# Altium schematic sheet LTEModule.SchDoc
size A4; SheetNumber: 11; SheetTotal: 22
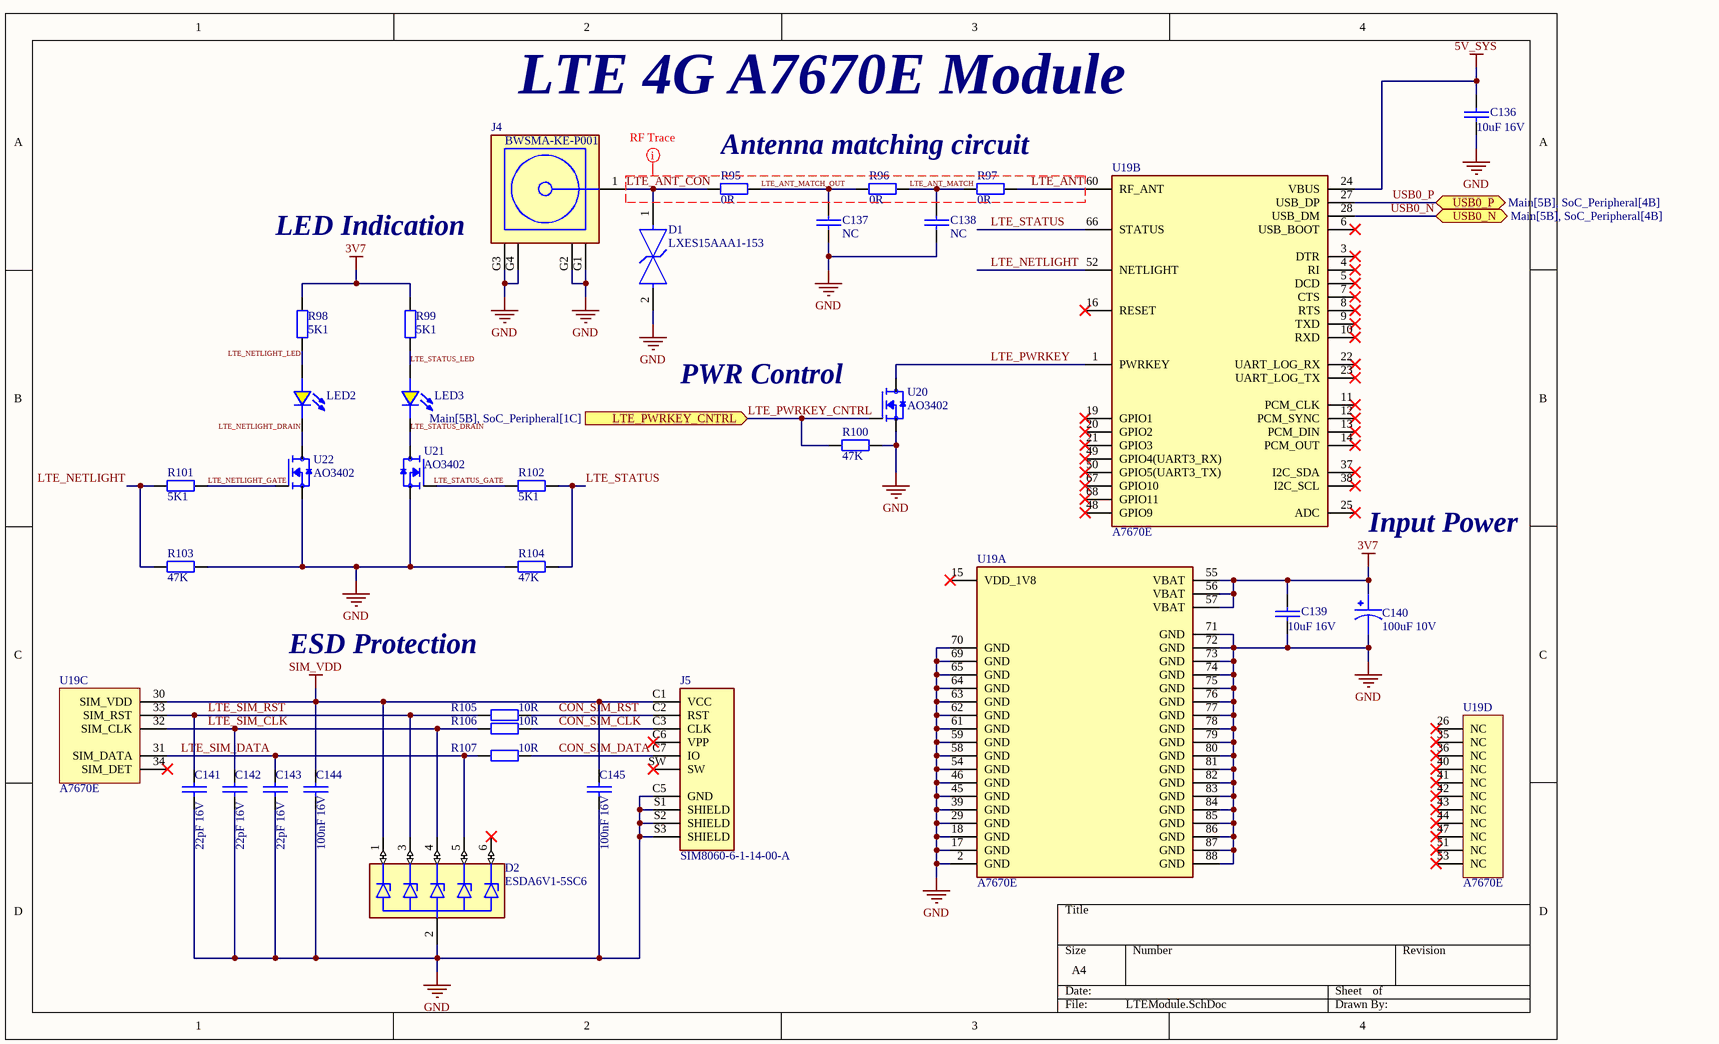
[diagram p0: LTEModule.SchDoc]

## Parts
C136  10uF 16V  [C_0603]
C137  NC  [C_0402]
C138  NC  [C_0402]
C139  10uF 16V  [C_0603]
C140  100uF 10V  [C_CASE-B]
C141  22pF 16V  [C_0402]
C142  22pF 16V  [C_0402]
C143  22pF 16V  [C_0402]
C144  100nF 16V  [C_0402]
C145  100nF 16V  [C_0402]
D1  LXES15AAA1-153  [FP-LXES15-MFG]
D2  ESDA6V1-5SC6  [SOT-23-6]
J4  BWSMA-KE-P001  [BATWIRELESS_BWSMA-KE-P001]
J5  SIM8060-6-1-14-00-A  [SIM8060-6-1-14-00-A]
LED2  LED_0603_YELLOW  [LED_0603]  (value not drawn)
LED3  LED_0603_YELLOW  [LED_0603]  (value not drawn)
R95  0R  [R_0402]
R96  0R  [R_0402]
R97  0R  [R_0402]
R98  5K1  [R_0603]
R99  5K1  [R_0603]
R100  47K  [R_0603]
R101  5K1  [R_0603]
R102  5K1  [R_0603]
R103  47K  [R_0603]
R104  47K  [R_0603]
R105  10R  [R_0402]
R106  10R  [R_0402]
R107  10R  [R_0402]
U19  A7670E  [A7670]  (parts A,B,C,D of 4)
U20  AO3402  [SOT-23-3]
U21  AO3402  [SOT-23-3]
U22  AO3402  [SOT-23-3]

## Ports
LTE_PWRKEY_CNTRL (in, see Main[5B], SoC_Peripheral[1C]), USB0_N (bidir, see Main[5B], SoC_Peripheral[4B]), USB0_P (bidir, see Main[5B], SoC_Peripheral[4B])

## Nets
3V7: C139.1 C140.1 R98.1 R99.1 U19.55(VBAT) U19.56(VBAT) U19.57(VBAT)
5V_SYS: C136.1 U19.24(VBUS)
GND: C136.2 C137.2 C138.2 C139.2 C140.2 C141.2 C142.2 C143.2 C144.2 C145.2 D1.2 D2.2(GND) J4.G1(GND) J4.G2(GND) J4.G3(GND) J4.G4(GND) J5.C5(GND) J5.S1(SHIELD) J5.S2(SHIELD) J5.S3(SHIELD) R100.2 R103.2 R104.1 U19.2(GND) U19.17(GND) U19.18(GND) U19.29(GND) U19.39(GND) U19.45(GND) U19.46(GND) U19.54(GND) U19.58(GND) U19.59(GND) U19.61(GND) U19.62(GND) U19.63(GND) U19.64(GND) U19.65(GND) U19.69(GND) U19.70(GND) U19.71(GND) U19.72(GND) U19.73(GND) U19.74(GND) U19.75(GND) U19.76(GND) U19.77(GND) U19.78(GND) U19.79(GND) U19.80(GND) U19.81(GND) U19.82(GND) U19.83(GND) U19.84(GND) U19.85(GND) U19.86(GND) U19.87(GND) U19.88(GND) U20.2(S) U21.2(S) U22.2(S)
SIM_VDD: C144.1 C145.1 D2.1(I/O1) J5.C1(VCC) U19.30(SIM_VDD)
CON_SIM_CLK: J5.C3(CLK) R106.1
CON_SIM_DATA: J5.C7(IO) R107.1
CON_SIM_RST: J5.C2(RST) R105.1
LTE_ANT: R97.2 U19.60(RF_ANT)
LTE_ANT_CON: D1.1 J4.1(SIG) R95.1
LTE_ANT_MATCH: C138.1 R96.2 R97.1
LTE_ANT_MATCH_OUT: C137.1 R95.2 R96.1
LTE_NETLIGHT: R101.1 R103.1 U19.52(NETLIGHT)
LTE_NETLIGHT_DRAIN: LED2.2(C) U22.3(D)
LTE_NETLIGHT_GATE: R101.2 U22.1(G)
LTE_NETLIGHT_LED: LED2.1(A) R98.2
LTE_PWRKEY: U19.1(PWRKEY) U20.3(D)
LTE_PWRKEY_CNTRL: R100.1 U20.1(G) ; port LTE_PWRKEY_CNTRL
LTE_SIM_CLK: C142.1 D2.4(I/O3) R106.2 U19.32(SIM_CLK)
LTE_SIM_DATA: C143.1 D2.5(I/O4) R107.2 U19.31(SIM_DATA)
LTE_SIM_RST: C141.1 D2.3(I/O2) R105.2 U19.33(SIM_RST)
LTE_STATUS: R102.2 R104.2 U19.66(STATUS)
LTE_STATUS_DRAIN: LED3.2(C) U21.3(D)
LTE_STATUS_GATE: R102.1 U21.1(G)
LTE_STATUS_LED: LED3.1(A) R99.2
USB0_N: U19.28(USB_DM) ; port USB0_N
USB0_P: U19.27(USB_DP) ; port USB0_P

Not connected (* = marked no-connect by the designer): D2 6(I/O5)*; J5 C6(VPP)* SW*; U19 3(DTR)* 4(RI)* 5(DCD)* 6(USB_BOOT)* 7(CTS)* 8(RTS)* 9(TXD)* 10(RXD)* 11(PCM_CLK)* 12(PCM_SYNC)* 13(PCM_DIN)* 14(PCM_OUT)* 15(VDD_1V8)* 16(RESET)* 19(GPIO1)* 20(GPIO2)* 21(GPIO3)* 22(UART_LOG_RX)* 23(UART_LOG_TX)* 25(ADC)* 26(NC)* 34(SIM_DET)* 35(NC)* 36(NC)* 37(I2C_SDA)* 38(I2C_SCL)* 40(NC)* 41(NC)* 42(NC)* 43(NC)* 44(NC)* 47(NC)* 48(GPIO9)* 49(GPIO4(UART3_RX))* 50(GPIO5(UART3_TX))* 51(NC)* 53(NC)* 67(GPIO10)* 68(GPIO11)*

## Layout directives
net class RF_TRACE: LTE_ANT, LTE_ANT_CON, LTE_ANT_MATCH, LTE_ANT_MATCH_OUT

## Notes on the sheet
- LTE 4G A7670E Module
- Antenna matching circuit
- (near J4) LED Indication
- PWR Control
- Input Power
- ESD Protection

## Library data of the parts
C136 C139 = C_0603: Capacitor 0603 SMD
C137 C138 C141-C145 = C_0402: Capacitor 0402 SMD
C140 = C_CASE-B-3528-21: Tantalum capacitor CASE-B-3528-21
D1 = CMP-06195-000025-1: TVS DIODE 4V 1005; Power Line Protection: No; Number of Bidirectional Channels: 1; Resistor Type: Zener; Case/Package: 0402; Max Operating Temperature: 85°C; Case Code (Metric): 1005; Packaging: Tape and Reel; Min Operating Temperature: -40°C; Mount: Surface Mount; Reverse Standoff Voltage: 4V; Case Code (Imperial): 0402
D2 = ESDA6V1-5SC6: 11.4V Clamp 7A (8/20µs) Ipp Tvs Diode Surface Mount SOT-23-6; Manufacturer: STMicroelectronics; Manufacturer Part Number: ESDA6V1-5SC6; ComponentLink1Description: Datasheet Link; ComponentLink1URL: https://www.st.com/resource/en/datasheet/esda6v1-5sc6.pdf
J4 = BWSMA-KE-P001: 1 Inner Hole SMA Board-End Staggered pins 50Ω 5.2mm SMD Coaxial Connectors (RF) ROHS; Manufacturer: BAT WIRELESS; Manufacturer Part Number: BWSMA-KE-P001; Datasheet Link: https://www.lcsc.com/datasheet/lcsc_datasheet_2410121647_BAT-WIRELESS-BWSMA-KE-P001_C496550.pdf
J5 = SIM8060-6-1-14-00-A: 6 Position Card Connector NANO SIM Surface Mount, Right Angle Gold; Manufacturer: Global Connector Technology; Manufacturer Part Number: SIM8060-6-1-14-00-A; ComponentLink1Description: Datasheet Link; ComponentLink1URL: https://www.tme.eu/Document/cb0a1a43149419081a289087b1ef4c50/SIM8060-6-0-14-00A.pdf
R95-R97 R105-R107 = R_0402: Resistor 0402 SMD
R98-R104 = R_0603: Resistor 0603 SMD
U19 = A7670E: LTE Cat 1 module; Manufacturer: SIMCom Wireless Solutions; Manufacturer Part Number: A7670E-LASE; Datasheet Link: https://nostris.ee/pdf/A7670%20Series%20Hardware%20Design_V1.00.pdf
U20-U22 = AO3402: N-Channel 30 V 4A (Ta) 1.4W (Ta) Surface Mount SOT-23-3; Manufacturer: Alpha & Omega Semicon; Manufacturer Part Number: AO3402; ComponentLink1Description: Datasheet Link; ComponentLink1URL: https://www.lcsc.com/datasheet/lcsc_datasheet_2410121835_Alpha---Omega-Semicon-AO3402_C14385.pdf